# EAGLE schematic triac (EAGLE 6.6.0)
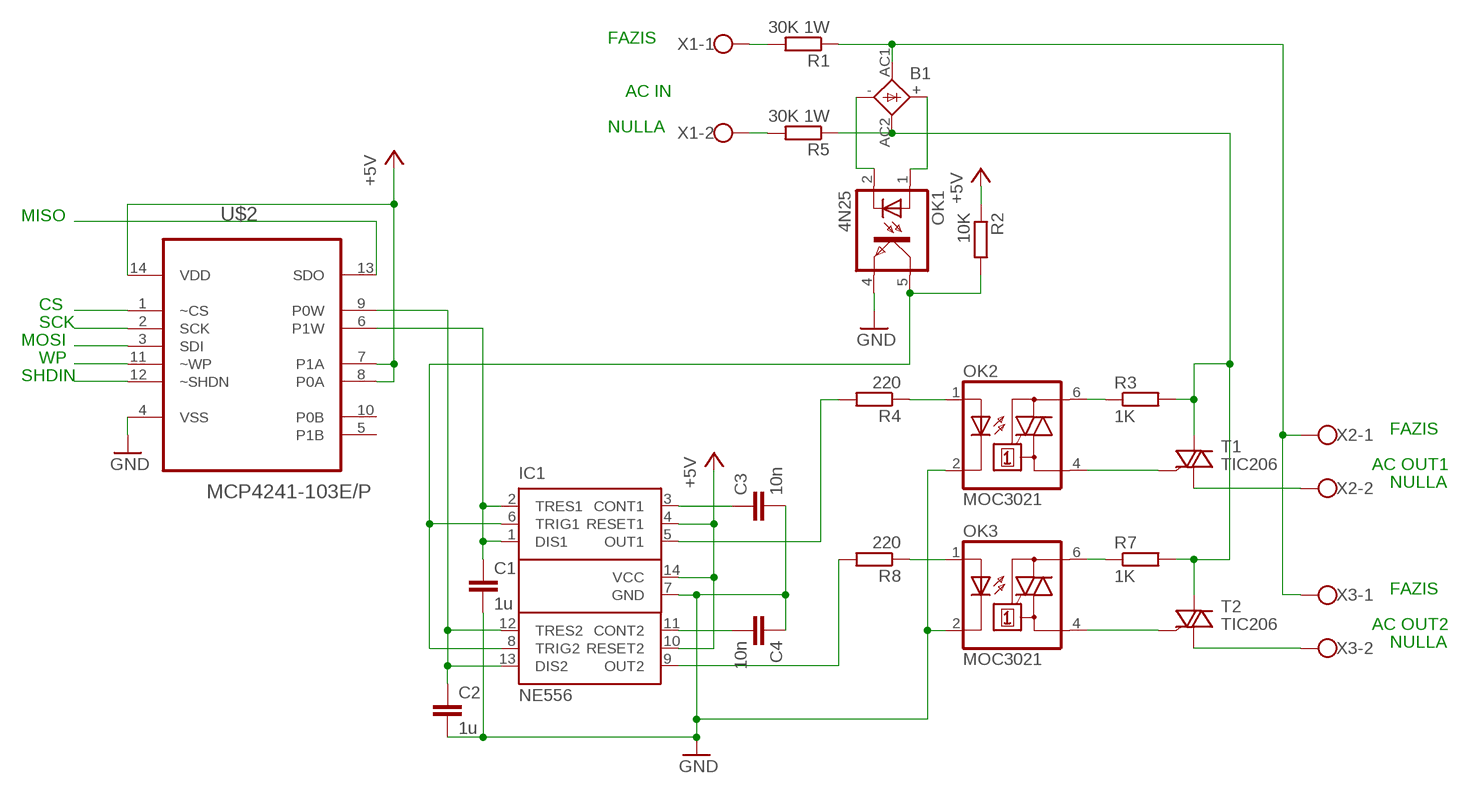
[diagram p0: schematic, sheet 1]

## Parts
B1  2KBB  [2KBB]
C1  1u  C-EU050-055X075  [C050-055X075]
C2  1u  C-EU050-055X075  [C050-055X075]
C3  10n  C-EU050-055X075  [C050-055X075]
C4  10n  C-EU050-055X075  [C050-055X075]
IC1  NE556  [DIL14]
OK1  4N25  CNY17F  [DIL06]
OK2  MOC3021  MOC3031M  [DIL06]
OK3  MOC3021  MOC3031M  [DIL06]
R1  30K 1W  R-EU_0207/10  [0207/10]
R2  10K  R-EU_0207/10  [0207/10]
R3  1K  R-EU_0207/10  [0207/10]
R4  220  R-EU_0207/10  [0207/10]
R5  30K 1W  R-EU_0207/10  [0207/10]
R7  1K  R-EU_0207/10  [0207/10]
R8  220  R-EU_0207/10  [0207/10]
T1  TIC206  BT138-H  [TO220BH]
T2  TIC206  BT138-H  [TO220BH]
U$2  MCP4241-103E/P  [DIP254P762X533-14]
X1  W237-102  [W237-102]
X2  W237-102  [W237-102]
X3  W237-102  [W237-102]

## Nets
+5V: IC1.4(RESET1) IC1.10(RESET2) IC1.14(VCC) R2.1 U$2.7(P1A) U$2.8(P0A) U$2.14(VDD)
GND: C1.2 C2.2 C3.2 C4.1 IC1.7(GND) OK1.4(EMIT) OK2.2(C) OK3.2(C) U$2.4(VSS)
N$1: B1.- OK1.2(C)
N$2: T1.T1(A1) X2.2
N$3: R5.2 X1.2
N$4: T2.T1(A1) X3.2
N$5: OK2.4(A1) T1.G
N$6: OK2.6(A2) R3.1
N$7: OK3.4(A1) T2.G
N$8: B1.AC2 R3.2 R5.1 R7.2 T1.T2(A2) T2.T2(A2)
N$9: OK2.1(A) R4.1
N$10: OK3.6(A2) R7.1
N$11: OK3.1(A) R8.1
N$12: C1.1 IC1.1(DIS1) IC1.2(TRES1) U$2.6(P1W)
N$13: C2.1 IC1.12(TRES2) IC1.13(DIS2) U$2.9(P0W)
N$14: IC1.6(TRIG1) IC1.8(TRIG2) OK1.5(COL) R2.2
N$16: C3.1 IC1.3(CONT1)
N$17: U$2.1(~CS)
N$18: C4.2 IC1.11(CONT2)
N$19: IC1.9(OUT2) R8.2
N$20: IC1.5(OUT1) R4.2
N$21: B1.+ OK1.1(A)
N$22: U$2.2(SCK)
N$23: U$2.3(SDI)
N$24: U$2.11(~WP)
N$25: U$2.12(~SHDN)
N$26: U$2.13(SDO)
N$27: R1.2 X1.1
N$28: B1.AC1 R1.1 X2.1 X3.1
Unconnected: U$2.5(P1B) U$2.10(P0B)

## Notes on the sheet
- FAZIS
- AC IN
- NULLA
- MISO
- CS
- SCK
- MOSI
- WP
- SHDIN
- FAZIS
- AC OUT1
- NULLA
- FAZIS
- AC OUT2
- NULLA

## Library data of the parts
B1 = rectifier:2KBB: RECTIFIER grid 3 x 5 mm
C1-C4 = rcl:C-EU: CAPACITOR, European symbol
IC1 = st-microelectronics:NE556: General Purpose Biopolartimer; MPN: NE556; OC_FARNELL: 2349784; OC_NEWARK: 83C0108
OK1 = optocoupler:CNY17F: SIEMENS OPTO COUPLER; MF: VISHAY/TELEFUNKEN; MPN: CNY17F-3; OC_FARNELL: 1469473; OC_NEWARK: 58K0172
OK2 OK3 = optocoupler:MOC30*: 6-Pin DIP Zero-Cross Optoisolators Triac Driver Output (250/400 Volt Peak) Source: http://www.fairchildsemi.com/ds/MO/MOC3043-M.pdf; MF: FAIRCHILD SEMICONDUCTOR; MPN: MOC3031M; OC_FARNELL: 9875964; OC_NEWARK: 78K6089
R1-R5 R7 R8 = rcl:R-EU_: RESISTOR, European symbol
T1 T2 = triac:BT138: TRIAC Source: http://www.semiconductors.philips.com BT138_SERIES_2.pdf
U$2 = Saját:MCP4241-103E/P: Digital POT; MPN: MCP4241-103E/P; OC_FARNELL: 1578439; OC_NEWARK: 08N6507; PACKAGE: DIP-14; SUPPLIER: Microchip
X1-X3 = con-wago-500:W237-102: WAGO SCREW CLAMP; MPN: 237-102; OC_FARNELL: unknown; OC_NEWARK: 70K9898